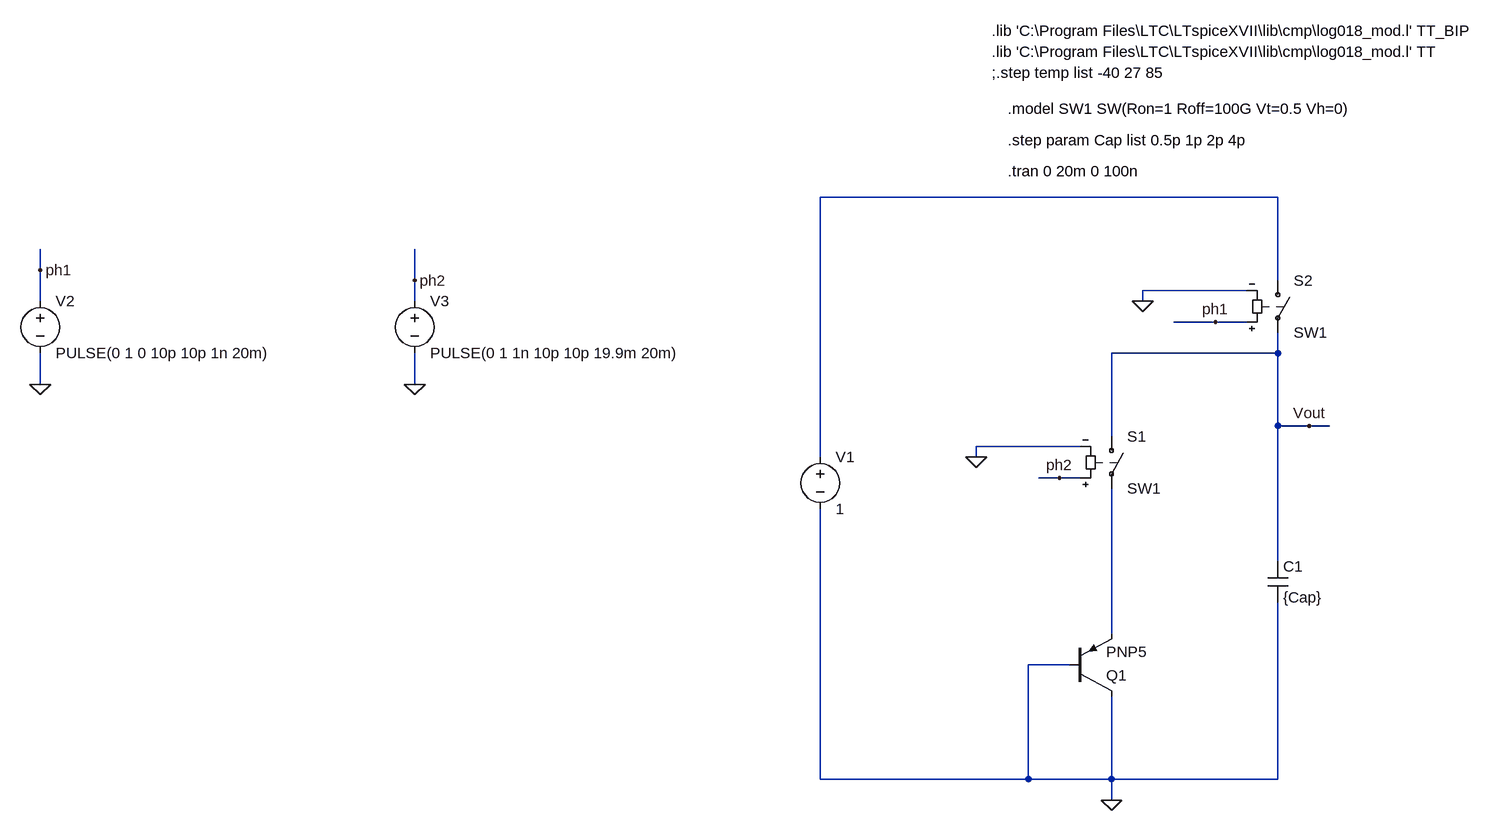
[diagram p0: schematic CB_BJT_Ib.asc]
CB_BJT_Ib.asc, the LTspice schematic file:
Version 4
SHEET 1 2248 788
WIRE 656 -288 -48 -288
WIRE -1248 -176 -1248 -208
WIRE -672 -160 -672 -208
WIRE 656 -160 656 -288
WIRE 608 -144 448 -144
WIRE -1248 -128 -1248 -176
WIRE -672 -128 -672 -160
WIRE 448 -128 448 -144
WIRE 560 -96 496 -96
WIRE 608 -96 560 -96
WIRE 656 -48 656 -80
WIRE 656 -48 400 -48
WIRE -1248 0 -1248 -48
WIRE -672 0 -672 -48
WIRE 656 64 656 -48
WIRE 704 64 656 64
WIRE 736 64 704 64
WIRE 400 80 400 -48
WIRE 352 96 192 96
WIRE -48 112 -48 -288
WIRE 192 112 192 96
WIRE 320 144 288 144
WIRE 352 144 320 144
WIRE 656 272 656 64
WIRE 400 384 400 160
WIRE 336 432 272 432
WIRE -48 608 -48 192
WIRE 272 608 272 432
WIRE 272 608 -48 608
WIRE 400 608 400 480
WIRE 400 608 272 608
WIRE 656 608 656 336
WIRE 656 608 400 608
WIRE 400 640 400 608
FLAG 400 640 0
FLAG 192 112 0
FLAG 448 -128 0
FLAG -1248 0 0
FLAG -1248 -176 ph1
FLAG 560 -96 ph1
FLAG 320 144 ph2
FLAG -672 0 0
FLAG -672 -160 ph2
FLAG 704 64 Vout
SYMBOL pnp2 336 480 M180
SYMATTR InstName Q1
SYMATTR Value PNP5
SYMBOL voltage -48 96 R0
WINDOW 123 0 0 Left 0
WINDOW 39 0 0 Left 0
SYMATTR InstName V1
SYMATTR Value 1
SYMBOL cap 640 272 R0
SYMATTR InstName C1
SYMATTR Value {Cap}
SYMBOL sw 400 64 R0
SYMATTR InstName S1
SYMATTR Value SW1
SYMBOL sw 656 -176 R0
SYMATTR InstName S2
SYMATTR Value SW1
SYMBOL voltage -1248 -144 R0
WINDOW 123 0 0 Left 0
WINDOW 39 0 0 Left 0
SYMATTR InstName V2
SYMATTR Value PULSE(0 1 0 10p 10p 1n 20m)
SYMBOL voltage -672 -144 R0
WINDOW 123 0 0 Left 0
WINDOW 39 0 0 Left 0
SYMATTR InstName V3
SYMATTR Value PULSE(0 1 1n 10p 10p 19.9m 20m)
TEXT 216 -480 Left 2 !;.step temp list -40 27 85
TEXT 216 -512 Left 2 !.lib 'C:\\Program Files\\LTC\\LTspiceXVII\\lib\\cmp\\log018_mod.l' TT
TEXT 216 -544 Left 2 !.lib 'C:\\Program Files\\LTC\\LTspiceXVII\\lib\\cmp\\log018_mod.l' TT_BIP
TEXT 240 -424 Left 2 !.model SW1 SW(Ron=1 Roff=100G Vt=0.5 Vh=0)
TEXT 240 -328 Left 2 !.tran 0 20m 0 100n
TEXT 240 -376 Left 2 !.step param Cap list 0.5p 1p 2p 4p

The netlist it stands for:
* CB_BJT_Ib.asc
Q1 0 0 N002 0 PNP5
V1 N001 0 1
C1 Vout 0 {Cap}
S1 Vout N002 ph2 0 SW1
S2 N001 Vout ph1 0 SW1
V2 ph1 0 PULSE(0 1 0 10p 10p 1n 20m)
V3 ph2 0 PULSE(0 1 1n 10p 10p 19.9m 20m)
.model NPN NPN
.model PNP PNP
.lib standard.bjt
;.step temp list -40 27 85
.lib 'C:\Program Files\LTC\LTspiceXVII\lib\cmp\log018_mod.l' TT
.lib 'C:\Program Files\LTC\LTspiceXVII\lib\cmp\log018_mod.l' TT_BIP
.model SW1 SW(Ron=1 Roff=100G Vt=0.5 Vh=0)
.tran 0 20m 0 100n
.step param Cap list 0.5p 1p 2p 4p
.backanno
.end